# EAGLE design rfid_v3 (EAGLE 6.5.0)
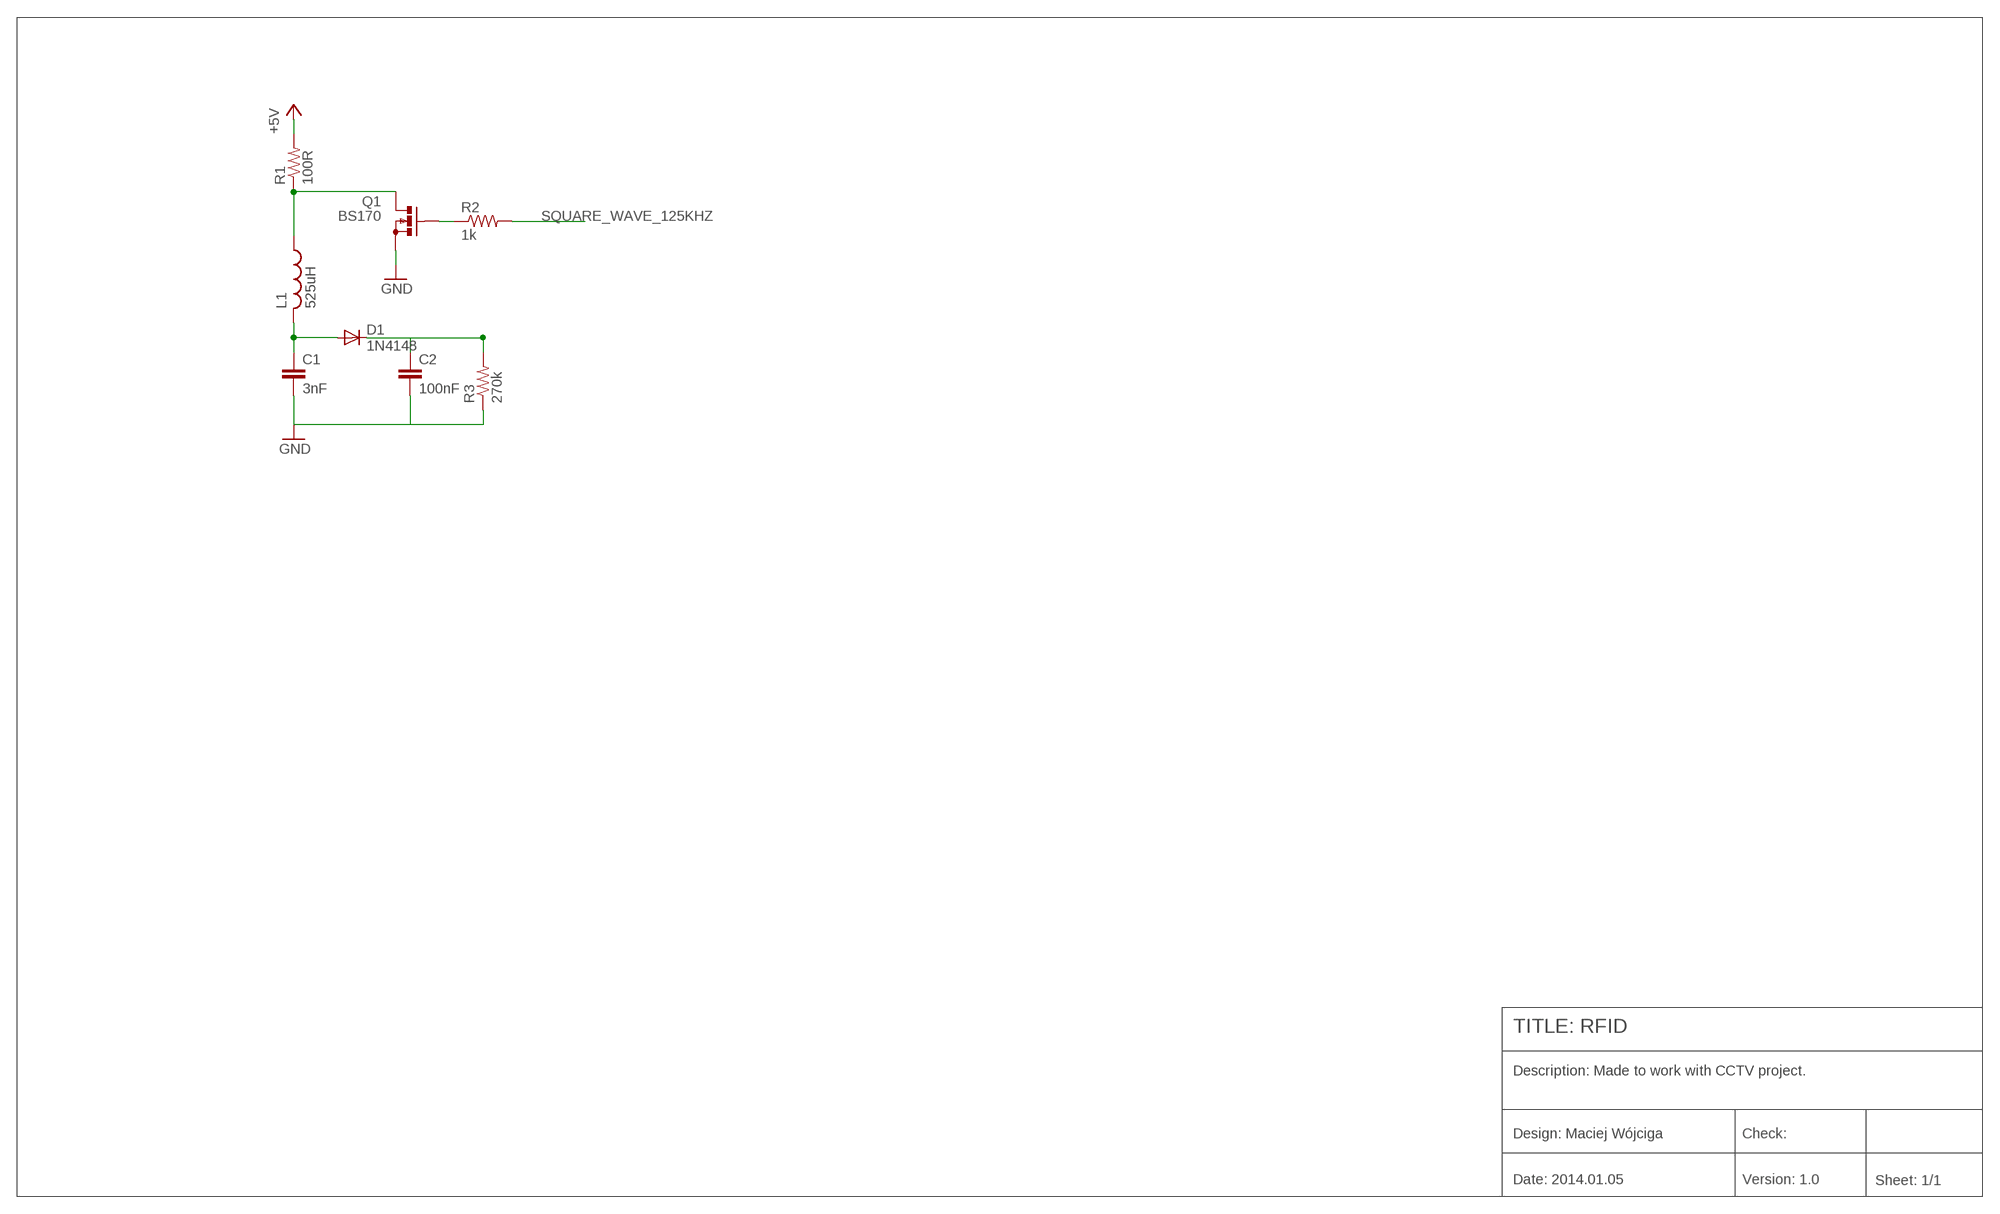
[diagram p0: schematic, sheet 1]

## Parts
C1  3nF  C-EU025-050X050  [C025-050X050]
C2  100nF  C-EU025-050X050  [C025-050X050]
D1  1N4148  1N4148DO35-7  [DO35-7]
L1  525uH  L-US0204/5  [0204/5]
Q1  BS170  [SOT54E]
R1  100R  R-US_0309/10  [0309/10]
R2  1k  R-US_0309/10  [0309/10]
R3  270k  R-US_0309/10  [0309/10]

## Nets
+5V: R1.2
GND: C1.2 C2.2 Q1.S R3.1
N$1: Q1.G R2.1
N$2: L1.1 Q1.D R1.1
N$3: C1.1 D1.A L1.2
N$4: C2.1 D1.C R3.2
SQUARE_WAVE_125KHZ: R2.2

## Notes on the sheet
- TITLE: RFID
- Description: Made to work with CCTV project.
- Design: Maciej Wójciga | Check:
- Date: 2014.01.05 | Version: 1.0 | Sheet: 1/1

## Library data of the parts
C1 C2 = rcl:C-EU: CAPACITOR, European symbol
D1 = diode:1N4148: DIODE high speed (Philips)
L1 = rcl:L-US: INDUCTOR, American symbol
Q1 = transistor-small-signal:BS170: N-CHANNEL MOS FET
R1-R3 = rcl:R-US_: RESISTOR, American symbol

## Board
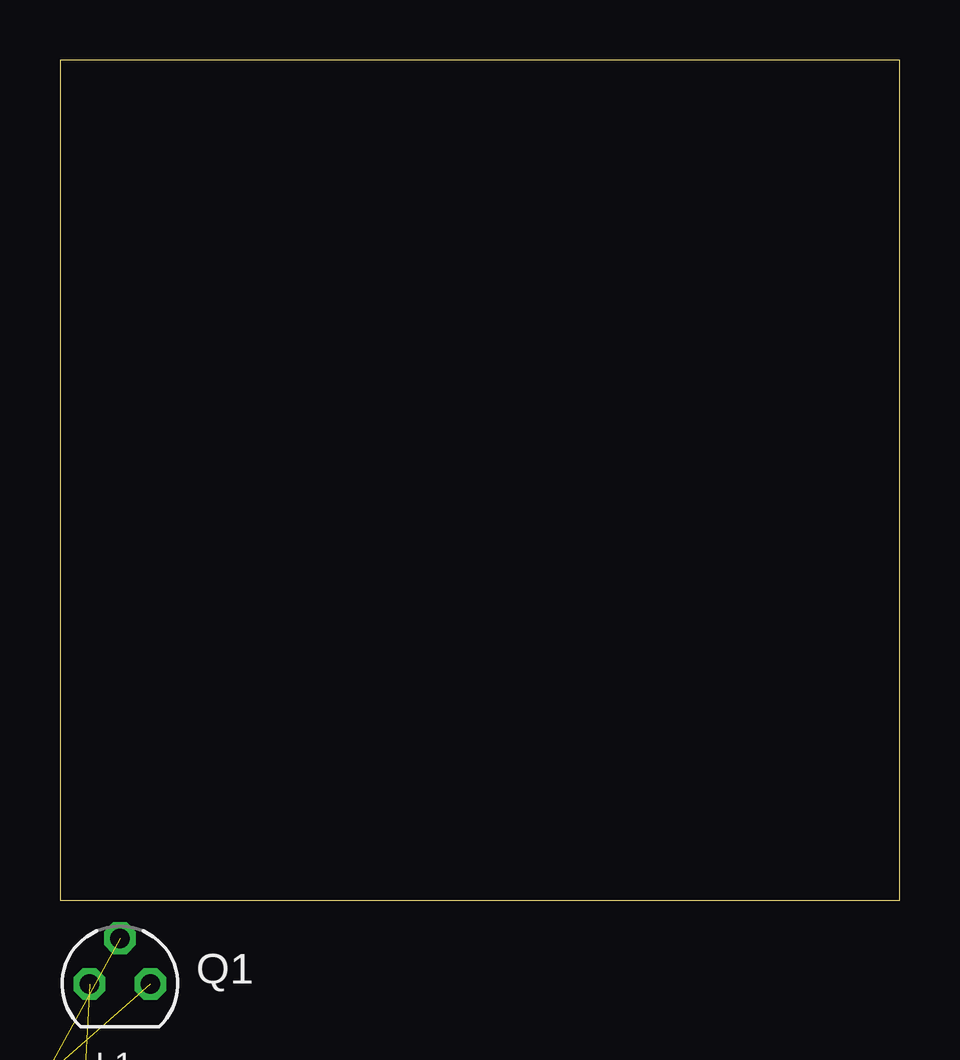
[diagram p1: board, top side]
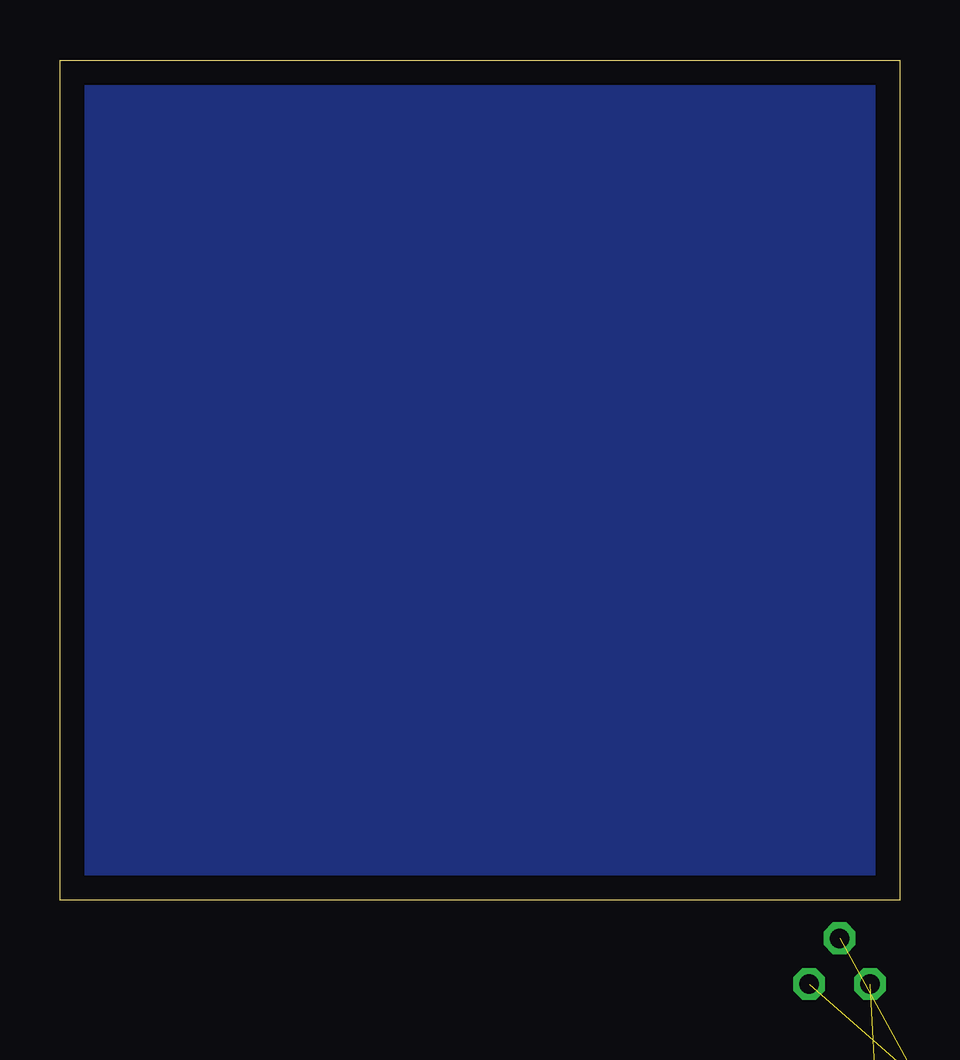
[diagram p2: board, bottom side, seen from below]

Size 35 x 35 mm. Coordinates in mm from the lower left corner, seen from the top.
Outline: 0,0 35,0 35,35 0,35 0,0
Copper layers (1*16): Top 0.035mm / dielectric 1.5mm / Bottom 0.035mm
Design rules "default": minimum track width 10mil, minimum drill 24mil, track to track 8mil, track to pad 8mil, pad to pad 8mil, via to via 8mil, smd to smd 8mil, copper to edge 40mil, drill to drill 8mil, minimum pad ring 10mil, minimum via ring 8mil, stop-mask expansion 4mil, vias tented up to drill 0mil, thermal gap 10mil

### Footprints (pad centres in the part's own frame; a part is rotated, then mirrored left to right if it is on the bottom)
C025-050X050 = drill 0.813 octagon: 1 -1.27,0; 2 1.27,0
DO35-7 = drill 0.813 long: A 3.81,0; C -3.81,0
0204/5 = drill 0.813 octagon: 1 -2.54,0; 2 2.54,0
SOT54E = drill 0.813 octagon: D -1.27,0; G 0,1.905; S 1.27,0
0309/10 = drill 0.813 octagon: 1 -5.08,0; 2 5.08,0

### Placement (x,y rotation side)
C1  -5.5,-10.5 0 top  (outside the outline)
C2  -13.5,-21.5 0 top  (outside the outline)
D1  -10,-29.5 0 top  (outside the outline)
L1  3.5,-8.5 0 top  (outside the outline)
Q1  2.5,-3.5 0 top
R1  -10,-36.5 0 top  (outside the outline)
R2  -2,-19 0 top  (outside the outline)
R3  -2,-24.5 0 top  (outside the outline)

### Tracks (layer width: path | path; a pad name or v marks a point on that pad's centre or on a via)
GND  (3 unrouted)
  pour Bottom (isolate 0.406): 0,35 35,35 35,0 0,0
N$1  (1 unrouted)
N$2  (2 unrouted)
N$3  (2 unrouted)
N$4  (2 unrouted)